# Altium schematic sheet adc-ADS7952.SchDoc
size A4; DocumentNumber: 11; SheetNumber: 11; SheetTotal: 11
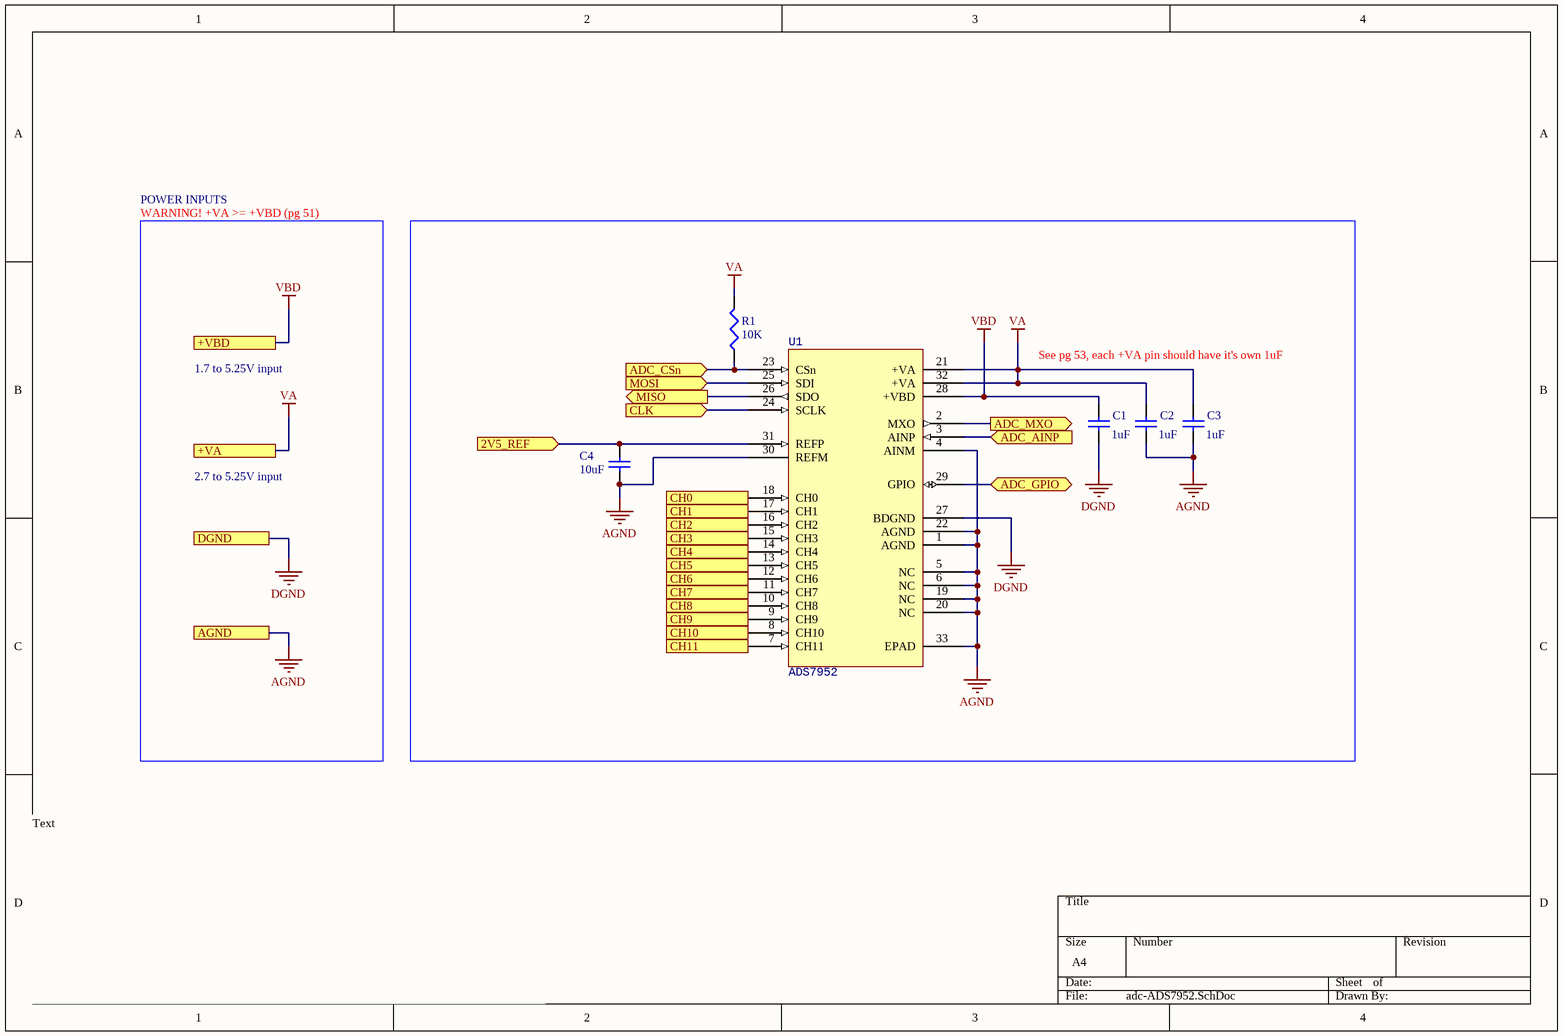
[diagram p0: adc-ADS7952.SchDoc]

## Parts
C1  1uF  [1608[0603]]
C2  1uF  [1608[0603]]
C3  1uF  [1608[0603]]
C4  10uF  [1608[0603]]
R1  10K  [J1-0603]
U1  ADS7952  [QFN50P500X500X100-33]

## Blocks framed on the sheet
See pg 53, each +VA pin should have it's own 1uF: C1-C4 R1 U1

## Ports
2V5_REF (in), +VA, +VBD, ADC_AINP (in), ADC_CSn (in), ADC_GPIO (bidir), ADC_MXO (out), AGND, CH0 (in), CH1 (in), CH2 (in), CH3 (in), CH4 (in), CH5 (in), CH6 (in), CH7 (in), CH8 (in), CH9 (in), CH10 (in), CH11 (in), CLK (in), DGND, MISO (out), MOSI (in)

## Nets
AGND: C2.1 C3.1 C4.1 U1.1(AGND) U1.4(AINM) U1.5(NC) U1.6(NC) U1.19(NC) U1.20(NC) U1.22(AGND) U1.30(REFM) U1.33(EPAD) ; port AGND
DGND: C1.1 U1.27(BDGND) ; port DGND
VA: C2.2 C3.2 R1.2 U1.21(+VA) U1.32(+VA) ; port +VA
VBD: C1.2 U1.28(+VBD) ; port +VBD
2V5_REF: C4.2 U1.31(REFP) ; port 2V5_REF
ADC_AINP: U1.3(AINP) ; port ADC_AINP
ADC_CSn: R1.1 U1.23(CSn) ; port ADC_CSn
ADC_GPIO: U1.29(GPIO) ; port ADC_GPIO
ADC_MXO: U1.2(MXO) ; port ADC_MXO
CH0: U1.18(CH0) ; port CH0
CH1: U1.17(CH1) ; port CH1
CH2: U1.16(CH2) ; port CH2
CH3: U1.15(CH3) ; port CH3
CH4: U1.14(CH4) ; port CH4
CH5: U1.13(CH5) ; port CH5
CH6: U1.12(CH6) ; port CH6
CH7: U1.11(CH7) ; port CH7
CH8: U1.10(CH8) ; port CH8
CH9: U1.9(CH9) ; port CH9
CH10: U1.8(CH10) ; port CH10
CH11: U1.7(CH11) ; port CH11
CLK: U1.24(SCLK) ; port CLK
MISO: U1.26(SDO) ; port MISO
MOSI: U1.25(SDI) ; port MOSI

## Notes on the sheet
- POWER INPUTS
- WARNING! +VA >= +VBD (pg 51)
- 1.7 to 5.25V input
- 2.7 to 5.25V input
- Text

## Library data of the parts
C1-C3 = Cap Semi: Capacitor (Semiconductor SIM Model); Published: 8-Jun-2000; LatestRevisionDate: 29-May-2009; LatestRevisionNote: IPC-7351 Footprint Added.; PackageReference: C1206; Publisher: Altium Limited; PackageDescription: Chip Capacitor; Supplier: Digi-Key; Supplier Part Number: 490-1550-1-ND; Value: 1uF
C4 = Cap: Capacitor; Published: 8-Jun-2000; LatestRevisionDate: 17-Jul-2002; LatestRevisionNote: Re-released for DXP Platform.; PackageReference: *; Publisher: Altium Limited; PackageDescription: Radial Cap, Thru-Hole; 2 Leads; 0.3 in Pin Spacing; Supplier: Digi-Key; Supplier Part Number: 587-3258-1-ND; Value: 10uF
R1 = Res3: Resistor; Published: 8-Jun-2000; LatestRevisionDate: 29-May-2009; LatestRevisionNote: IPC-7351 Footprint Added.; PackageReference: J1-0603; Publisher: Altium Limited; PackageDescription: Chip Resistor; Supplier: Digi-Key; Value: 10K
U1 = ADS7952: 12 bit, 12 channel analog-to-digital converter with SPI interface.; Supplier 1: Digi-Key